# Altium schematic sheet CPU_Logic.SchDoc: Title
size A1; Date: Date; CompanyName: Integrated Micro-Electronics Bulgaria; Organization: Design & Development Department; Address1: Drawing Type; Address2: Address 1; Address3: Address 2; Address4: Address 3; DocumentNumber: 730xxx; Revision: 01; SheetNumber: 1; SheetTotal: 1; PageSetup: Record=PageOptions|CenterHorizontal=True|CenterVertical=True|PrintScale=0.70|XCorrection=1.00|YCorrection=1.00|PrintKind=2|BorderSize=5000000|LeftOffset=0|BottomOffset=0|Orientation=2|PaperLength=1000|PaperWidth=1000|Scale=100|PaperSource=7|PrintQuality=-4|MediaType=1|DitherType=10|PaperKind=A4|PrintScaleMode=1; SheetSize: A3; Time: Time; ModifiedDate: Mod. Date
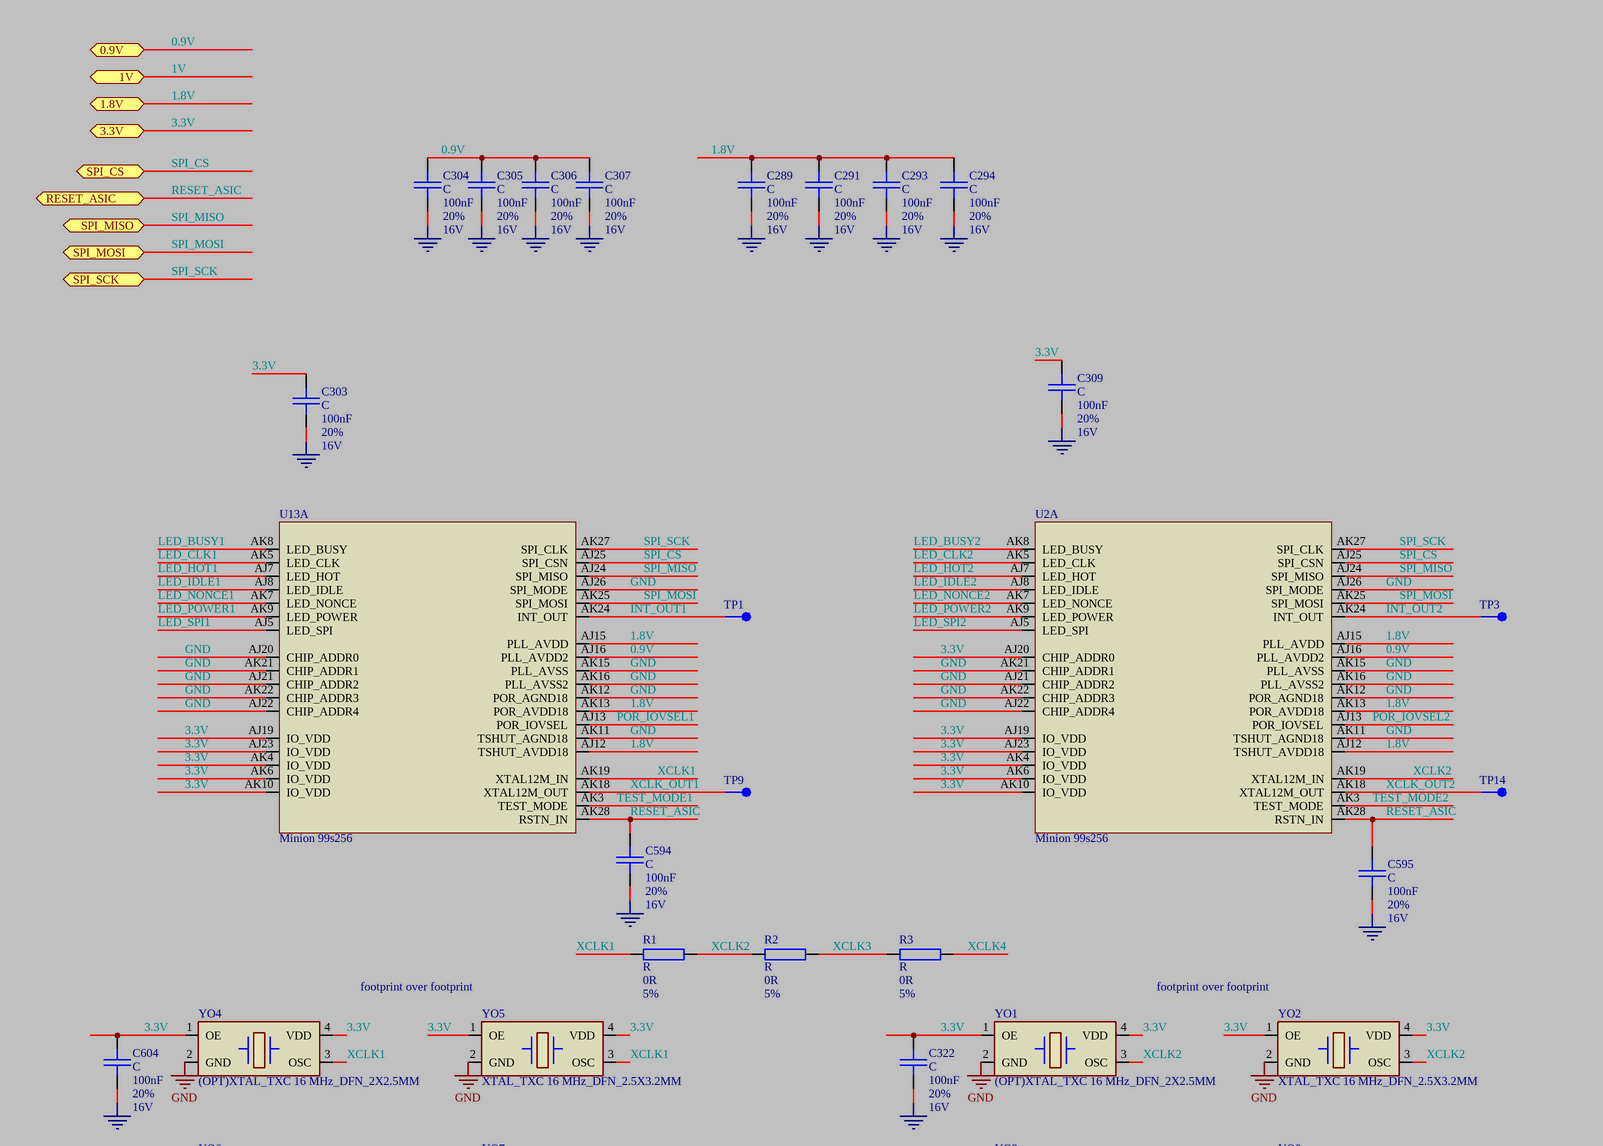
[diagram p0: CPU_Logic.SchDoc, top left]
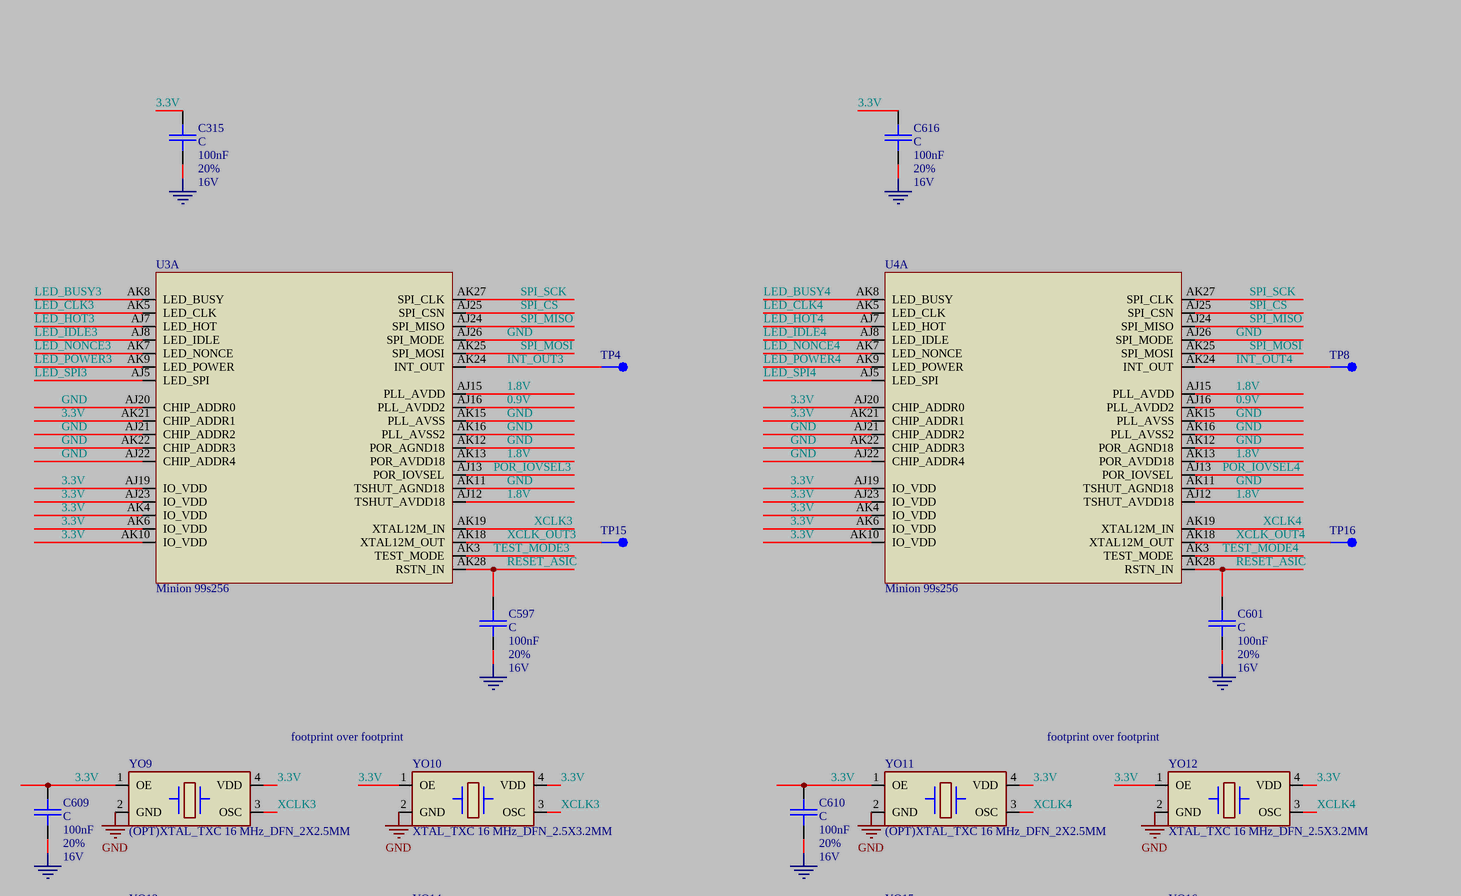
[diagram p1: CPU_Logic.SchDoc, top right]
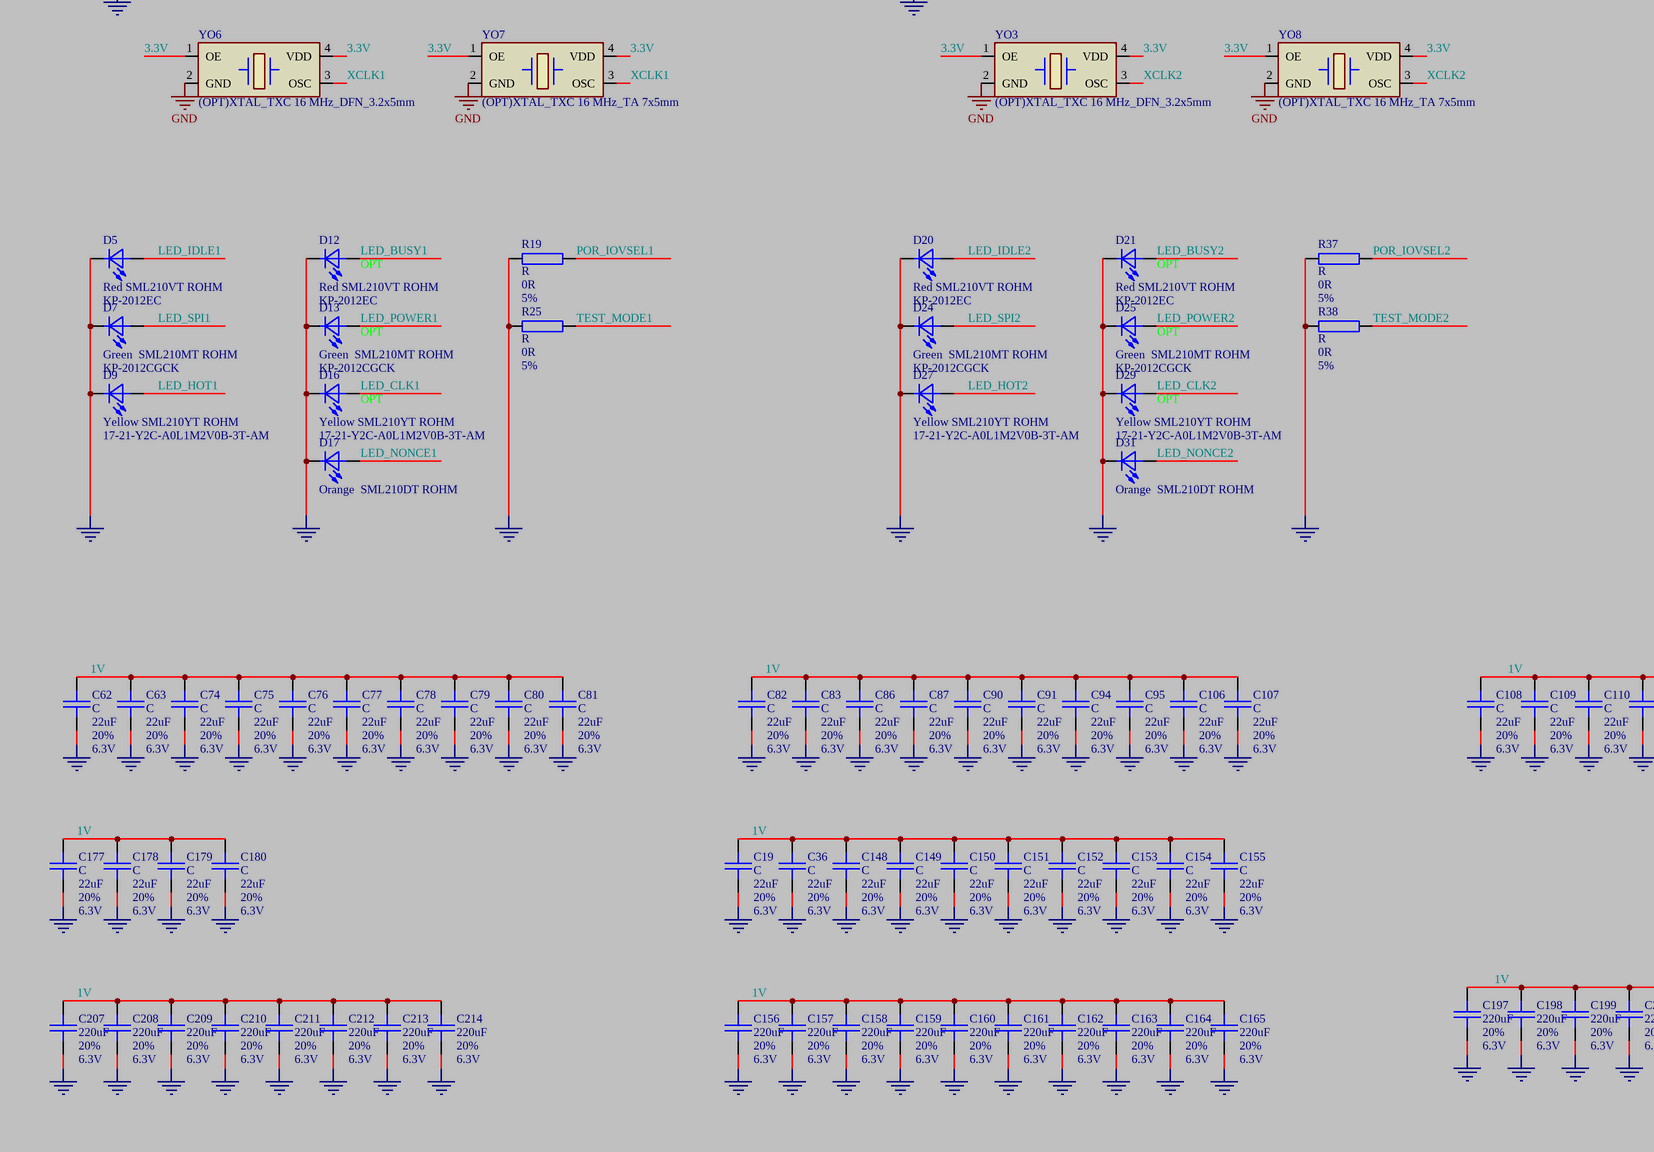
[diagram p2: CPU_Logic.SchDoc, bottom left]
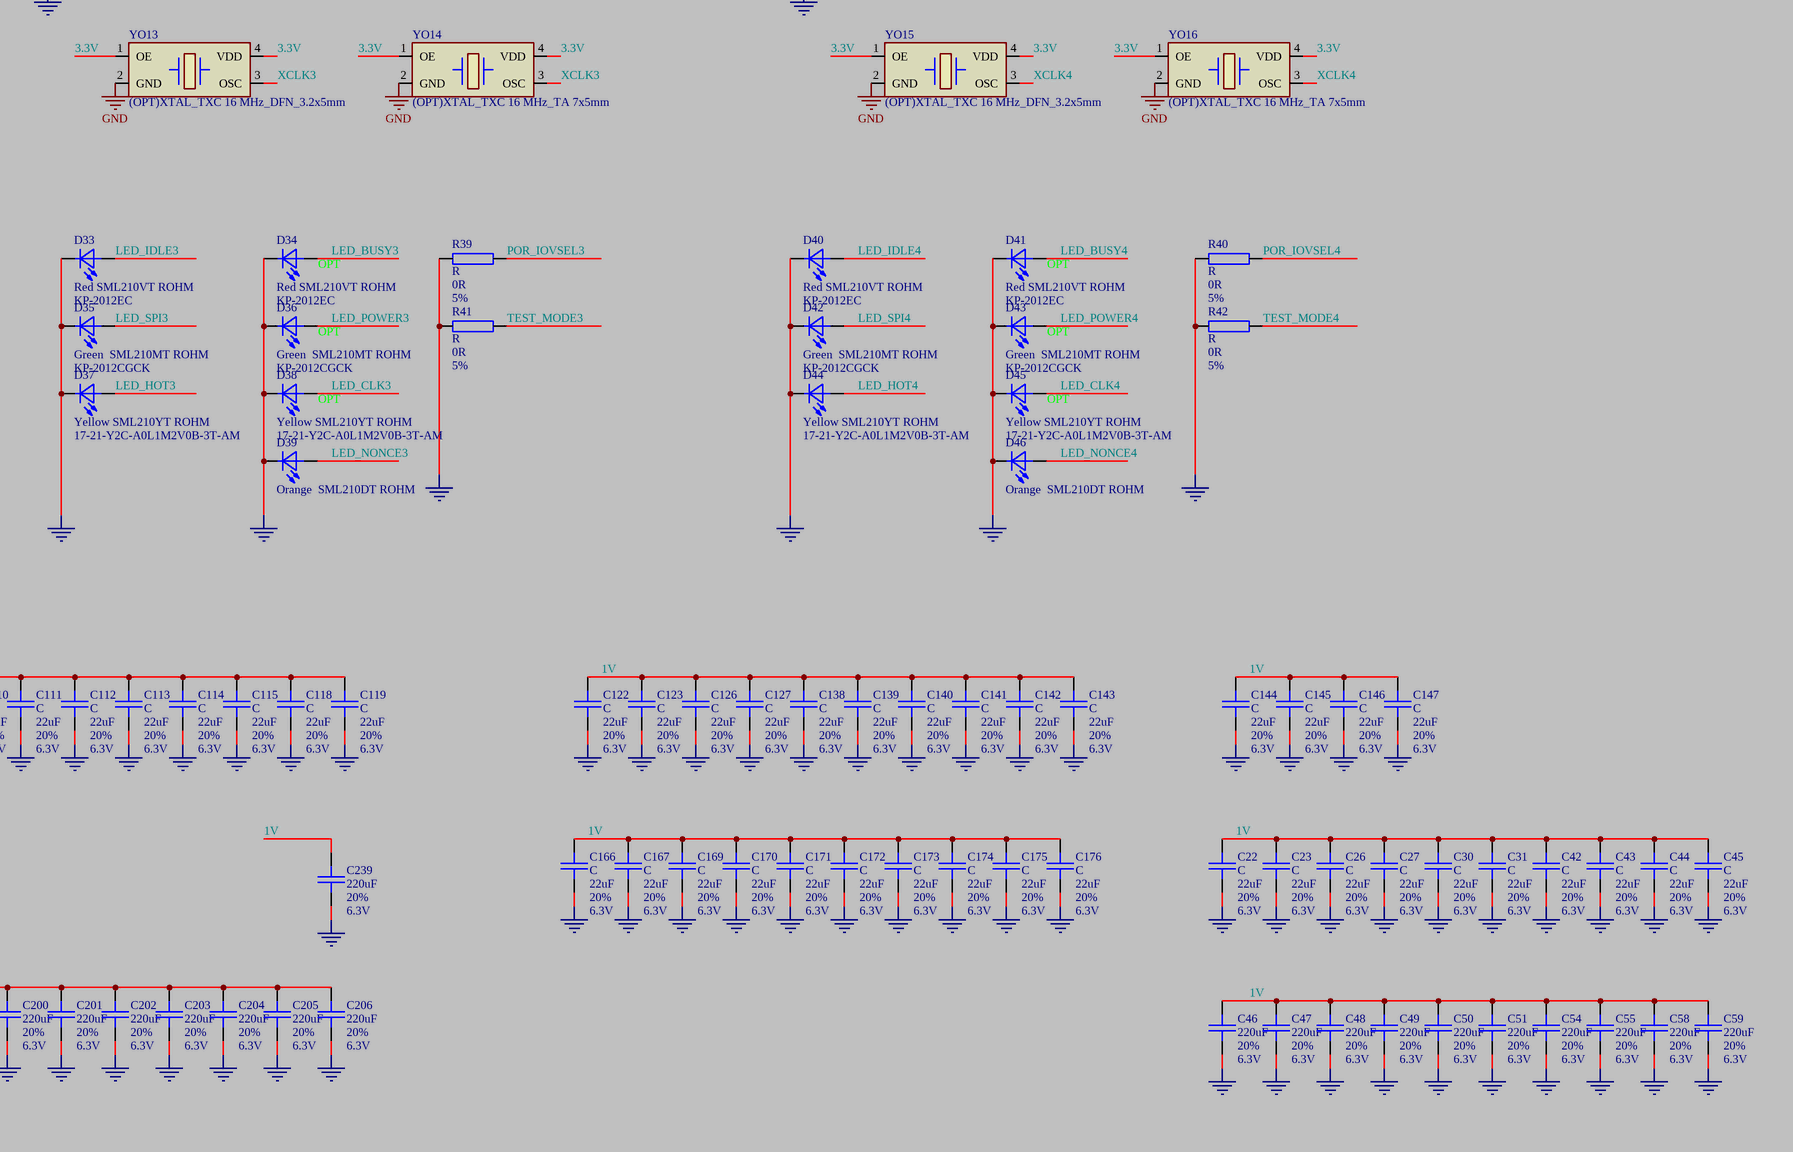
[diagram p3: CPU_Logic.SchDoc, bottom right]

## Parts
C19  C  DB_VALUE: 22uF  DB_TOLERANCE: 20%  DB_VOLTAGE: 6.3V  [SMD_0805_CAPC2012X145N]
C22  C  DB_VALUE: 22uF  DB_TOLERANCE: 20%  DB_VOLTAGE: 6.3V  [SMD_0805_CAPC2012X145N]
C23  C  DB_VALUE: 22uF  DB_TOLERANCE: 20%  DB_VOLTAGE: 6.3V  [SMD_0805_CAPC2012X145N]
C26  C  DB_VALUE: 22uF  DB_TOLERANCE: 20%  DB_VOLTAGE: 6.3V  [SMD_0805_CAPC2012X145N]
C27  C  DB_VALUE: 22uF  DB_TOLERANCE: 20%  DB_VOLTAGE: 6.3V  [SMD_0805_CAPC2012X145N]
C30  C  DB_VALUE: 22uF  DB_TOLERANCE: 20%  DB_VOLTAGE: 6.3V  [SMD_0805_CAPC2012X145N]
C31  C  DB_VALUE: 22uF  DB_TOLERANCE: 20%  DB_VOLTAGE: 6.3V  [SMD_0805_CAPC2012X145N]
C36  C  DB_VALUE: 22uF  DB_TOLERANCE: 20%  DB_VOLTAGE: 6.3V  [SMD_0805_CAPC2012X145N]
C42  C  DB_VALUE: 22uF  DB_TOLERANCE: 20%  DB_VOLTAGE: 6.3V  [SMD_0805_CAPC2012X145N]
C43  C  DB_VALUE: 22uF  DB_TOLERANCE: 20%  DB_VOLTAGE: 6.3V  [SMD_0805_CAPC2012X145N]
C44  C  DB_VALUE: 22uF  DB_TOLERANCE: 20%  DB_VOLTAGE: 6.3V  [SMD_0805_CAPC2012X145N]
C45  C  DB_VALUE: 22uF  DB_TOLERANCE: 20%  DB_VOLTAGE: 6.3V  [SMD_0805_CAPC2012X145N]
C46  DB_VALUE: 220uF  DB_TOLERANCE: 20%  DB_VOLTAGE: 6.3V  [SMD_1210_CAPC3225X279N]  (hidden comment: C)
C47  DB_VALUE: 220uF  DB_TOLERANCE: 20%  DB_VOLTAGE: 6.3V  [SMD_1210_CAPC3225X279N]  (hidden comment: C)
C48  DB_VALUE: 220uF  DB_TOLERANCE: 20%  DB_VOLTAGE: 6.3V  [SMD_1210_CAPC3225X279N]  (hidden comment: C)
C49  DB_VALUE: 220uF  DB_TOLERANCE: 20%  DB_VOLTAGE: 6.3V  [SMD_1210_CAPC3225X279N]  (hidden comment: C)
C50  DB_VALUE: 220uF  DB_TOLERANCE: 20%  DB_VOLTAGE: 6.3V  [SMD_1210_CAPC3225X279N]  (hidden comment: C)
C51  DB_VALUE: 220uF  DB_TOLERANCE: 20%  DB_VOLTAGE: 6.3V  [SMD_1210_CAPC3225X279N]  (hidden comment: C)
C54  DB_VALUE: 220uF  DB_TOLERANCE: 20%  DB_VOLTAGE: 6.3V  [SMD_1210_CAPC3225X279N]  (hidden comment: C)
C55  DB_VALUE: 220uF  DB_TOLERANCE: 20%  DB_VOLTAGE: 6.3V  [SMD_1210_CAPC3225X279N]  (hidden comment: C)
C58  DB_VALUE: 220uF  DB_TOLERANCE: 20%  DB_VOLTAGE: 6.3V  [SMD_1210_CAPC3225X279N]  (hidden comment: C)
C59  DB_VALUE: 220uF  DB_TOLERANCE: 20%  DB_VOLTAGE: 6.3V  [SMD_1210_CAPC3225X279N]  (hidden comment: C)
C62  C  DB_VALUE: 22uF  DB_TOLERANCE: 20%  DB_VOLTAGE: 6.3V  [SMD_0805_CAPC2012X145N]
C63  C  DB_VALUE: 22uF  DB_TOLERANCE: 20%  DB_VOLTAGE: 6.3V  [SMD_0805_CAPC2012X145N]
C74  C  DB_VALUE: 22uF  DB_TOLERANCE: 20%  DB_VOLTAGE: 6.3V  [SMD_0805_CAPC2012X145N]
C75  C  DB_VALUE: 22uF  DB_TOLERANCE: 20%  DB_VOLTAGE: 6.3V  [SMD_0805_CAPC2012X145N]
C76  C  DB_VALUE: 22uF  DB_TOLERANCE: 20%  DB_VOLTAGE: 6.3V  [SMD_0805_CAPC2012X145N]
C77  C  DB_VALUE: 22uF  DB_TOLERANCE: 20%  DB_VOLTAGE: 6.3V  [SMD_0805_CAPC2012X145N]
C78  C  DB_VALUE: 22uF  DB_TOLERANCE: 20%  DB_VOLTAGE: 6.3V  [SMD_0805_CAPC2012X145N]
C79  C  DB_VALUE: 22uF  DB_TOLERANCE: 20%  DB_VOLTAGE: 6.3V  [SMD_0805_CAPC2012X145N]
C80  C  DB_VALUE: 22uF  DB_TOLERANCE: 20%  DB_VOLTAGE: 6.3V  [SMD_0805_CAPC2012X145N]
C81  C  DB_VALUE: 22uF  DB_TOLERANCE: 20%  DB_VOLTAGE: 6.3V  [SMD_0805_CAPC2012X145N]
C82  C  DB_VALUE: 22uF  DB_TOLERANCE: 20%  DB_VOLTAGE: 6.3V  [SMD_0805_CAPC2012X145N]
C83  C  DB_VALUE: 22uF  DB_TOLERANCE: 20%  DB_VOLTAGE: 6.3V  [SMD_0805_CAPC2012X145N]
C86  C  DB_VALUE: 22uF  DB_TOLERANCE: 20%  DB_VOLTAGE: 6.3V  [SMD_0805_CAPC2012X145N]
C87  C  DB_VALUE: 22uF  DB_TOLERANCE: 20%  DB_VOLTAGE: 6.3V  [SMD_0805_CAPC2012X145N]
C90  C  DB_VALUE: 22uF  DB_TOLERANCE: 20%  DB_VOLTAGE: 6.3V  [SMD_0805_CAPC2012X145N]
C91  C  DB_VALUE: 22uF  DB_TOLERANCE: 20%  DB_VOLTAGE: 6.3V  [SMD_0805_CAPC2012X145N]
C94  C  DB_VALUE: 22uF  DB_TOLERANCE: 20%  DB_VOLTAGE: 6.3V  [SMD_0805_CAPC2012X145N]
C95  C  DB_VALUE: 22uF  DB_TOLERANCE: 20%  DB_VOLTAGE: 6.3V  [SMD_0805_CAPC2012X145N]
C106  C  DB_VALUE: 22uF  DB_TOLERANCE: 20%  DB_VOLTAGE: 6.3V  [SMD_0805_CAPC2012X145N]
C107  C  DB_VALUE: 22uF  DB_TOLERANCE: 20%  DB_VOLTAGE: 6.3V  [SMD_0805_CAPC2012X145N]
C108  C  DB_VALUE: 22uF  DB_TOLERANCE: 20%  DB_VOLTAGE: 6.3V  [SMD_0805_CAPC2012X145N]
C109  C  DB_VALUE: 22uF  DB_TOLERANCE: 20%  DB_VOLTAGE: 6.3V  [SMD_0805_CAPC2012X145N]
C110  C  DB_VALUE: 22uF  DB_TOLERANCE: 20%  DB_VOLTAGE: 6.3V  [SMD_0805_CAPC2012X145N]
C111  C  DB_VALUE: 22uF  DB_TOLERANCE: 20%  DB_VOLTAGE: 6.3V  [SMD_0805_CAPC2012X145N]
C112  C  DB_VALUE: 22uF  DB_TOLERANCE: 20%  DB_VOLTAGE: 6.3V  [SMD_0805_CAPC2012X145N]
C113  C  DB_VALUE: 22uF  DB_TOLERANCE: 20%  DB_VOLTAGE: 6.3V  [SMD_0805_CAPC2012X145N]
C114  C  DB_VALUE: 22uF  DB_TOLERANCE: 20%  DB_VOLTAGE: 6.3V  [SMD_0805_CAPC2012X145N]
C115  C  DB_VALUE: 22uF  DB_TOLERANCE: 20%  DB_VOLTAGE: 6.3V  [SMD_0805_CAPC2012X145N]
C118  C  DB_VALUE: 22uF  DB_TOLERANCE: 20%  DB_VOLTAGE: 6.3V  [SMD_0805_CAPC2012X145N]
C119  C  DB_VALUE: 22uF  DB_TOLERANCE: 20%  DB_VOLTAGE: 6.3V  [SMD_0805_CAPC2012X145N]
C122  C  DB_VALUE: 22uF  DB_TOLERANCE: 20%  DB_VOLTAGE: 6.3V  [SMD_0805_CAPC2012X145N]
C123  C  DB_VALUE: 22uF  DB_TOLERANCE: 20%  DB_VOLTAGE: 6.3V  [SMD_0805_CAPC2012X145N]
C126  C  DB_VALUE: 22uF  DB_TOLERANCE: 20%  DB_VOLTAGE: 6.3V  [SMD_0805_CAPC2012X145N]
C127  C  DB_VALUE: 22uF  DB_TOLERANCE: 20%  DB_VOLTAGE: 6.3V  [SMD_0805_CAPC2012X145N]
C138  C  DB_VALUE: 22uF  DB_TOLERANCE: 20%  DB_VOLTAGE: 6.3V  [SMD_0805_CAPC2012X145N]
C139  C  DB_VALUE: 22uF  DB_TOLERANCE: 20%  DB_VOLTAGE: 6.3V  [SMD_0805_CAPC2012X145N]
C140  C  DB_VALUE: 22uF  DB_TOLERANCE: 20%  DB_VOLTAGE: 6.3V  [SMD_0805_CAPC2012X145N]
C141  C  DB_VALUE: 22uF  DB_TOLERANCE: 20%  DB_VOLTAGE: 6.3V  [SMD_0805_CAPC2012X145N]
C142  C  DB_VALUE: 22uF  DB_TOLERANCE: 20%  DB_VOLTAGE: 6.3V  [SMD_0805_CAPC2012X145N]
C143  C  DB_VALUE: 22uF  DB_TOLERANCE: 20%  DB_VOLTAGE: 6.3V  [SMD_0805_CAPC2012X145N]
C144  C  DB_VALUE: 22uF  DB_TOLERANCE: 20%  DB_VOLTAGE: 6.3V  [SMD_0805_CAPC2012X145N]
C145  C  DB_VALUE: 22uF  DB_TOLERANCE: 20%  DB_VOLTAGE: 6.3V  [SMD_0805_CAPC2012X145N]
C146  C  DB_VALUE: 22uF  DB_TOLERANCE: 20%  DB_VOLTAGE: 6.3V  [SMD_0805_CAPC2012X145N]
C147  C  DB_VALUE: 22uF  DB_TOLERANCE: 20%  DB_VOLTAGE: 6.3V  [SMD_0805_CAPC2012X145N]
C148  C  DB_VALUE: 22uF  DB_TOLERANCE: 20%  DB_VOLTAGE: 6.3V  [SMD_0805_CAPC2012X145N]
C149  C  DB_VALUE: 22uF  DB_TOLERANCE: 20%  DB_VOLTAGE: 6.3V  [SMD_0805_CAPC2012X145N]
C150  C  DB_VALUE: 22uF  DB_TOLERANCE: 20%  DB_VOLTAGE: 6.3V  [SMD_0805_CAPC2012X145N]
C151  C  DB_VALUE: 22uF  DB_TOLERANCE: 20%  DB_VOLTAGE: 6.3V  [SMD_0805_CAPC2012X145N]
C152  C  DB_VALUE: 22uF  DB_TOLERANCE: 20%  DB_VOLTAGE: 6.3V  [SMD_0805_CAPC2012X145N]
C153  C  DB_VALUE: 22uF  DB_TOLERANCE: 20%  DB_VOLTAGE: 6.3V  [SMD_0805_CAPC2012X145N]
C154  C  DB_VALUE: 22uF  DB_TOLERANCE: 20%  DB_VOLTAGE: 6.3V  [SMD_0805_CAPC2012X145N]
C155  C  DB_VALUE: 22uF  DB_TOLERANCE: 20%  DB_VOLTAGE: 6.3V  [SMD_0805_CAPC2012X145N]
C156  DB_VALUE: 220uF  DB_TOLERANCE: 20%  DB_VOLTAGE: 6.3V  [SMD_1210_CAPC3225X279N]  (hidden comment: C)
C157  DB_VALUE: 220uF  DB_TOLERANCE: 20%  DB_VOLTAGE: 6.3V  [SMD_1210_CAPC3225X279N]  (hidden comment: C)
C158  DB_VALUE: 220uF  DB_TOLERANCE: 20%  DB_VOLTAGE: 6.3V  [SMD_1210_CAPC3225X279N]  (hidden comment: C)
C159  DB_VALUE: 220uF  DB_TOLERANCE: 20%  DB_VOLTAGE: 6.3V  [SMD_1210_CAPC3225X279N]  (hidden comment: C)
C160  DB_VALUE: 220uF  DB_TOLERANCE: 20%  DB_VOLTAGE: 6.3V  [SMD_1210_CAPC3225X279N]  (hidden comment: C)
C161  DB_VALUE: 220uF  DB_TOLERANCE: 20%  DB_VOLTAGE: 6.3V  [SMD_1210_CAPC3225X279N]  (hidden comment: C)
C162  DB_VALUE: 220uF  DB_TOLERANCE: 20%  DB_VOLTAGE: 6.3V  [SMD_1210_CAPC3225X279N]  (hidden comment: C)
C163  DB_VALUE: 220uF  DB_TOLERANCE: 20%  DB_VOLTAGE: 6.3V  [SMD_1210_CAPC3225X279N]  (hidden comment: C)
C164  DB_VALUE: 220uF  DB_TOLERANCE: 20%  DB_VOLTAGE: 6.3V  [SMD_1210_CAPC3225X279N]  (hidden comment: C)
C165  DB_VALUE: 220uF  DB_TOLERANCE: 20%  DB_VOLTAGE: 6.3V  [SMD_1210_CAPC3225X279N]  (hidden comment: C)
C166  C  DB_VALUE: 22uF  DB_TOLERANCE: 20%  DB_VOLTAGE: 6.3V  [SMD_0805_CAPC2012X145N]
C167  C  DB_VALUE: 22uF  DB_TOLERANCE: 20%  DB_VOLTAGE: 6.3V  [SMD_0805_CAPC2012X145N]
C169  C  DB_VALUE: 22uF  DB_TOLERANCE: 20%  DB_VOLTAGE: 6.3V  [SMD_0805_CAPC2012X145N]
C170  C  DB_VALUE: 22uF  DB_TOLERANCE: 20%  DB_VOLTAGE: 6.3V  [SMD_0805_CAPC2012X145N]
C171  C  DB_VALUE: 22uF  DB_TOLERANCE: 20%  DB_VOLTAGE: 6.3V  [SMD_0805_CAPC2012X145N]
C172  C  DB_VALUE: 22uF  DB_TOLERANCE: 20%  DB_VOLTAGE: 6.3V  [SMD_0805_CAPC2012X145N]
C173  C  DB_VALUE: 22uF  DB_TOLERANCE: 20%  DB_VOLTAGE: 6.3V  [SMD_0805_CAPC2012X145N]
C174  C  DB_VALUE: 22uF  DB_TOLERANCE: 20%  DB_VOLTAGE: 6.3V  [SMD_0805_CAPC2012X145N]
C175  C  DB_VALUE: 22uF  DB_TOLERANCE: 20%  DB_VOLTAGE: 6.3V  [SMD_0805_CAPC2012X145N]
C176  C  DB_VALUE: 22uF  DB_TOLERANCE: 20%  DB_VOLTAGE: 6.3V  [SMD_0805_CAPC2012X145N]
C177  C  DB_VALUE: 22uF  DB_TOLERANCE: 20%  DB_VOLTAGE: 6.3V  [SMD_0805_CAPC2012X145N]
C178  C  DB_VALUE: 22uF  DB_TOLERANCE: 20%  DB_VOLTAGE: 6.3V  [SMD_0805_CAPC2012X145N]
C179  C  DB_VALUE: 22uF  DB_TOLERANCE: 20%  DB_VOLTAGE: 6.3V  [SMD_0805_CAPC2012X145N]
C180  C  DB_VALUE: 22uF  DB_TOLERANCE: 20%  DB_VOLTAGE: 6.3V  [SMD_0805_CAPC2012X145N]
C197  DB_VALUE: 220uF  DB_TOLERANCE: 20%  DB_VOLTAGE: 6.3V  [SMD_1210_CAPC3225X279N]  (hidden comment: C)
C198  DB_VALUE: 220uF  DB_TOLERANCE: 20%  DB_VOLTAGE: 6.3V  [SMD_1210_CAPC3225X279N]  (hidden comment: C)
C199  DB_VALUE: 220uF  DB_TOLERANCE: 20%  DB_VOLTAGE: 6.3V  [SMD_1210_CAPC3225X279N]  (hidden comment: C)
C200  DB_VALUE: 220uF  DB_TOLERANCE: 20%  DB_VOLTAGE: 6.3V  [SMD_1210_CAPC3225X279N]  (hidden comment: C)
C201  DB_VALUE: 220uF  DB_TOLERANCE: 20%  DB_VOLTAGE: 6.3V  [SMD_1210_CAPC3225X279N]  (hidden comment: C)
C202  DB_VALUE: 220uF  DB_TOLERANCE: 20%  DB_VOLTAGE: 6.3V  [SMD_1210_CAPC3225X279N]  (hidden comment: C)
C203  DB_VALUE: 220uF  DB_TOLERANCE: 20%  DB_VOLTAGE: 6.3V  [SMD_1210_CAPC3225X279N]  (hidden comment: C)
C204  DB_VALUE: 220uF  DB_TOLERANCE: 20%  DB_VOLTAGE: 6.3V  [SMD_1210_CAPC3225X279N]  (hidden comment: C)
C205  DB_VALUE: 220uF  DB_TOLERANCE: 20%  DB_VOLTAGE: 6.3V  [SMD_1210_CAPC3225X279N]  (hidden comment: C)
C206  DB_VALUE: 220uF  DB_TOLERANCE: 20%  DB_VOLTAGE: 6.3V  [SMD_1210_CAPC3225X279N]  (hidden comment: C)
C207  DB_VALUE: 220uF  DB_TOLERANCE: 20%  DB_VOLTAGE: 6.3V  [SMD_1210_CAPC3225X279N]  (hidden comment: C)
C208  DB_VALUE: 220uF  DB_TOLERANCE: 20%  DB_VOLTAGE: 6.3V  [SMD_1210_CAPC3225X279N]  (hidden comment: C)
C209  DB_VALUE: 220uF  DB_TOLERANCE: 20%  DB_VOLTAGE: 6.3V  [SMD_1210_CAPC3225X279N]  (hidden comment: C)
C210  DB_VALUE: 220uF  DB_TOLERANCE: 20%  DB_VOLTAGE: 6.3V  [SMD_1210_CAPC3225X279N]  (hidden comment: C)
C211  DB_VALUE: 220uF  DB_TOLERANCE: 20%  DB_VOLTAGE: 6.3V  [SMD_1210_CAPC3225X279N]  (hidden comment: C)
C212  DB_VALUE: 220uF  DB_TOLERANCE: 20%  DB_VOLTAGE: 6.3V  [SMD_1210_CAPC3225X279N]  (hidden comment: C)
C213  DB_VALUE: 220uF  DB_TOLERANCE: 20%  DB_VOLTAGE: 6.3V  [SMD_1210_CAPC3225X279N]  (hidden comment: C)
C214  DB_VALUE: 220uF  DB_TOLERANCE: 20%  DB_VOLTAGE: 6.3V  [SMD_1210_CAPC3225X279N]  (hidden comment: C)
C239  DB_VALUE: 220uF  DB_TOLERANCE: 20%  DB_VOLTAGE: 6.3V  [SMD_1210_CAPC3225X279N]  (hidden comment: C)
C289  C  DB_VALUE: 100nF  DB_TOLERANCE: 20%  DB_VOLTAGE: 16V  [SMD_0603_CAPC1608X95N]
C291  C  DB_VALUE: 100nF  DB_TOLERANCE: 20%  DB_VOLTAGE: 16V  [SMD_0603_CAPC1608X95N]
C293  C  DB_VALUE: 100nF  DB_TOLERANCE: 20%  DB_VOLTAGE: 16V  [SMD_0603_CAPC1608X95N]
C294  C  DB_VALUE: 100nF  DB_TOLERANCE: 20%  DB_VOLTAGE: 16V  [SMD_0603_CAPC1608X95N]
C303  C  DB_VALUE: 100nF  DB_TOLERANCE: 20%  DB_VOLTAGE: 16V  [SMD_0603_CAPC1608X95N]
C304  C  DB_VALUE: 100nF  DB_TOLERANCE: 20%  DB_VOLTAGE: 16V  [SMD_0603_CAPC1608X95N]
C305  C  DB_VALUE: 100nF  DB_TOLERANCE: 20%  DB_VOLTAGE: 16V  [SMD_0603_CAPC1608X95N]
C306  C  DB_VALUE: 100nF  DB_TOLERANCE: 20%  DB_VOLTAGE: 16V  [SMD_0603_CAPC1608X95N]
C307  C  DB_VALUE: 100nF  DB_TOLERANCE: 20%  DB_VOLTAGE: 16V  [SMD_0603_CAPC1608X95N]
C309  C  DB_VALUE: 100nF  DB_TOLERANCE: 20%  DB_VOLTAGE: 16V  [SMD_0603_CAPC1608X95N]
C315  C  DB_VALUE: 100nF  DB_TOLERANCE: 20%  DB_VOLTAGE: 16V  [SMD_0603_CAPC1608X95N]
C322  C  DB_VALUE: 100nF  DB_TOLERANCE: 20%  DB_VOLTAGE: 16V  [SMD_0603_CAPC1608X95N]
C594  C  DB_VALUE: 100nF  DB_TOLERANCE: 20%  DB_VOLTAGE: 16V  [SMD_0603_CAPC1608X95N]
C595  C  DB_VALUE: 100nF  DB_TOLERANCE: 20%  DB_VOLTAGE: 16V  [SMD_0603_CAPC1608X95N]
C597  C  DB_VALUE: 100nF  DB_TOLERANCE: 20%  DB_VOLTAGE: 16V  [SMD_0603_CAPC1608X95N]
C601  C  DB_VALUE: 100nF  DB_TOLERANCE: 20%  DB_VOLTAGE: 16V  [SMD_0603_CAPC1608X95N]
C604  C  DB_VALUE: 100nF  DB_TOLERANCE: 20%  DB_VOLTAGE: 16V  [SMD_0603_CAPC1608X95N]
C609  C  DB_VALUE: 100nF  DB_TOLERANCE: 20%  DB_VOLTAGE: 16V  [SMD_0603_CAPC1608X95N]
C610  C  DB_VALUE: 100nF  DB_TOLERANCE: 20%  DB_VOLTAGE: 16V  [SMD_0603_CAPC1608X95N]
C616  C  DB_VALUE: 100nF  DB_TOLERANCE: 20%  DB_VOLTAGE: 16V  [SMD_0603_CAPC1608X95N]
D5  Red SML210VT ROHM  DB_VALUE: KP-2012EC  [SMD_0805_LED2012X100N]
D7  Green  SML210MT ROHM  DB_VALUE: KP-2012CGCK  [SMD_0805_LED2012X100N]
D9  Yellow SML210YT ROHM  DB_VALUE: 17-21-Y2C-A0L1M2V0B-3T-AM  [SMD_0805_LED2012X100N]
D12  Red SML210VT ROHM  DB_VALUE: KP-2012EC  [SMD_0805_LED2012X100N]
D13  Green  SML210MT ROHM  DB_VALUE: KP-2012CGCK  [SMD_0805_LED2012X100N]
D16  Yellow SML210YT ROHM  DB_VALUE: 17-21-Y2C-A0L1M2V0B-3T-AM  [SMD_0805_LED2012X100N]
D17  Orange  SML210DT ROHM  [SMD_0805_LED2012X100N]
D20  Red SML210VT ROHM  DB_VALUE: KP-2012EC  [SMD_0805_LED2012X100N]
D21  Red SML210VT ROHM  DB_VALUE: KP-2012EC  [SMD_0805_LED2012X100N]
D24  Green  SML210MT ROHM  DB_VALUE: KP-2012CGCK  [SMD_0805_LED2012X100N]
D25  Green  SML210MT ROHM  DB_VALUE: KP-2012CGCK  [SMD_0805_LED2012X100N]
D27  Yellow SML210YT ROHM  DB_VALUE: 17-21-Y2C-A0L1M2V0B-3T-AM  [SMD_0805_LED2012X100N]
D29  Yellow SML210YT ROHM  DB_VALUE: 17-21-Y2C-A0L1M2V0B-3T-AM  [SMD_0805_LED2012X100N]
D31  Orange  SML210DT ROHM  [SMD_0805_LED2012X100N]
D33  Red SML210VT ROHM  DB_VALUE: KP-2012EC  [SMD_0805_LED2012X100N]
D34  Red SML210VT ROHM  DB_VALUE: KP-2012EC  [SMD_0805_LED2012X100N]
D35  Green  SML210MT ROHM  DB_VALUE: KP-2012CGCK  [SMD_0805_LED2012X100N]
D36  Green  SML210MT ROHM  DB_VALUE: KP-2012CGCK  [SMD_0805_LED2012X100N]
D37  Yellow SML210YT ROHM  DB_VALUE: 17-21-Y2C-A0L1M2V0B-3T-AM  [SMD_0805_LED2012X100N]
D38  Yellow SML210YT ROHM  DB_VALUE: 17-21-Y2C-A0L1M2V0B-3T-AM  [SMD_0805_LED2012X100N]
D39  Orange  SML210DT ROHM  [SMD_0805_LED2012X100N]
D40  Red SML210VT ROHM  DB_VALUE: KP-2012EC  [SMD_0805_LED2012X100N]
D41  Red SML210VT ROHM  DB_VALUE: KP-2012EC  [SMD_0805_LED2012X100N]
D42  Green  SML210MT ROHM  DB_VALUE: KP-2012CGCK  [SMD_0805_LED2012X100N]
D43  Green  SML210MT ROHM  DB_VALUE: KP-2012CGCK  [SMD_0805_LED2012X100N]
D44  Yellow SML210YT ROHM  DB_VALUE: 17-21-Y2C-A0L1M2V0B-3T-AM  [SMD_0805_LED2012X100N]
D45  Yellow SML210YT ROHM  DB_VALUE: 17-21-Y2C-A0L1M2V0B-3T-AM  [SMD_0805_LED2012X100N]
D46  Orange  SML210DT ROHM  [SMD_0805_LED2012X100N]
R1  R  DB_VALUE: 0R  DB_TOLERANCE: 5%  [SMD_0603_RESC1608X55N]
R2  R  DB_VALUE: 0R  DB_TOLERANCE: 5%  [SMD_0603_RESC1608X55N]
R3  R  DB_VALUE: 0R  DB_TOLERANCE: 5%  [SMD_0603_RESC1608X55N]
R19  R  DB_VALUE: 0R  DB_TOLERANCE: 5%  [SMD_0603_RESC1608X55N]
R25  R  DB_VALUE: 0R  DB_TOLERANCE: 5%  [SMD_0603_RESC1608X55N]
R37  R  DB_VALUE: 0R  DB_TOLERANCE: 5%  [SMD_0603_RESC1608X55N]
R38  R  DB_VALUE: 0R  DB_TOLERANCE: 5%  [SMD_0603_RESC1608X55N]
R39  R  DB_VALUE: 0R  DB_TOLERANCE: 5%  [SMD_0603_RESC1608X55N]
R40  R  DB_VALUE: 0R  DB_TOLERANCE: 5%  [SMD_0603_RESC1608X55N]
R41  R  DB_VALUE: 0R  DB_TOLERANCE: 5%  [SMD_0603_RESC1608X55N]
R42  R  DB_VALUE: 0R  DB_TOLERANCE: 5%  [SMD_0603_RESC1608X55N]
TP1  TEST_POINT_1  [SMD_TP_100-254]  (value not drawn)
TP3  TEST_POINT_1  [SMD_TP_100-254]  (value not drawn)
TP4  TEST_POINT_1  [SMD_TP_100-254]  (value not drawn)
TP8  TEST_POINT_1  [SMD_TP_100-254]  (value not drawn)
TP9  TEST_POINT_1  [SMD_TP_100-254]  (value not drawn)
TP14  TEST_POINT_1  [SMD_TP_100-254]  (value not drawn)
TP15  TEST_POINT_1  [SMD_TP_100-254]  (value not drawn)
TP16  TEST_POINT_1  [SMD_TP_100-254]  (value not drawn)
U2  Minion 99s256  [SMD_BGA900C80P30X30]  (part A of 3)
U3  Minion 99s256  [SMD_BGA900C80P30X30]  (part A of 3)
U4  Minion 99s256  [SMD_BGA900C80P30X30]  (part A of 3)
U13  Minion 99s256  [SMD_BGA900C80P30X30]  (part A of 3)
YO1  (OPT)XTAL_TXC 16 MHz_DFN_2X2.5MM  [SMD_OSCCF200X250X90-4N]
YO2  XTAL_TXC 16 MHz_DFN_2.5X3.2MM  [SMD_OSCCF250X320X90-4N]
YO3  (OPT)XTAL_TXC 16 MHz_DFN_3.2x5mm  [SMD_OSCCF320X400X90-4N]
YO4  (OPT)XTAL_TXC 16 MHz_DFN_2X2.5MM  [SMD_OSCCF200X250X90-4N]
YO5  XTAL_TXC 16 MHz_DFN_2.5X3.2MM  [SMD_OSCCF250X320X90-4N]
YO6  (OPT)XTAL_TXC 16 MHz_DFN_3.2x5mm  [SMD_OSCCF320X400X90-4N]
YO7  (OPT)XTAL_TXC 16 MHz_TA 7x5mm  [SMD_OSCCC500X700X100-4N]
YO8  (OPT)XTAL_TXC 16 MHz_TA 7x5mm  [SMD_OSCCC500X700X100-4N]
YO9  (OPT)XTAL_TXC 16 MHz_DFN_2X2.5MM  [SMD_OSCCF200X250X90-4N]
YO10  XTAL_TXC 16 MHz_DFN_2.5X3.2MM  [SMD_OSCCF250X320X90-4N]
YO11  (OPT)XTAL_TXC 16 MHz_DFN_2X2.5MM  [SMD_OSCCF200X250X90-4N]
YO12  XTAL_TXC 16 MHz_DFN_2.5X3.2MM  [SMD_OSCCF250X320X90-4N]
YO13  (OPT)XTAL_TXC 16 MHz_DFN_3.2x5mm  [SMD_OSCCF320X400X90-4N]
YO14  (OPT)XTAL_TXC 16 MHz_TA 7x5mm  [SMD_OSCCC500X700X100-4N]
YO15  (OPT)XTAL_TXC 16 MHz_DFN_3.2x5mm  [SMD_OSCCF320X400X90-4N]
YO16  (OPT)XTAL_TXC 16 MHz_TA 7x5mm  [SMD_OSCCC500X700X100-4N]

## Ports
0.9V, 1.8V, 1V, 3.3V, RESET_ASIC, SPI_CS, SPI_MISO, SPI_MOSI, SPI_SCK

## Nets
GND: C19.1 C22.1 C23.1 C26.1 C27.1 C30.1 C31.1 C36.1 C42.1 C43.1 C44.1 C45.1 C46.1 C47.1 C48.1 C49.1 C50.1 C51.1 C54.1 C55.1 C58.1 C59.1 C62.1 C63.1 C74.1 C75.1 C76.1 C77.1 C78.1 C79.1 C80.1 C81.1 C82.1 C83.1 C86.1 C87.1 C90.1 C91.1 C94.1 C95.1 C106.1 C107.1 C108.1 C109.1 C110.1 C111.1 C112.1 C113.1 C114.1 C115.1 C118.1 C119.1 C122.1 C123.1 C126.1 C127.1 C138.1 C139.1 C140.1 C141.1 C142.1 C143.1 C144.1 C145.1 C146.1 C147.1 C148.1 C149.1 C150.1 C151.1 C152.1 C153.1 C154.1 C155.1 C156.1 C157.1 C158.1 C159.1 C160.1 C161.1 C162.1 C163.1 C164.1 C165.1 C166.1 C167.1 C169.1 C170.1 C171.1 C172.1 C173.1 C174.1 C175.1 C176.1 C177.1 C178.1 C179.1 C180.1 C197.1 C198.1 C199.1 C200.1 C201.1 C202.1 C203.1 C204.1 C205.1 C206.1 C207.1 C208.1 C209.1 C210.1 C211.1 C212.1 C213.1 C214.1 C239.1 C289.1 C291.1 C293.1 C294.1 C303.1 C304.1 C305.1 C306.1 C307.1 C309.1 C315.1 C322.2 C594.2 C595.2 C597.2 C601.2 C604.2 C609.2 C610.2 C616.1 D5.1(C) D7.1(C) D9.1(C) D12.1(C) D13.1(C) D16.1(C) D17.1(C) D20.1(C) D21.1(C) D24.1(C) D25.1(C) D27.1(C) D29.1(C) D31.1(C) D33.1(C) D34.1(C) D35.1(C) D36.1(C) D37.1(C) D38.1(C) D39.1(C) D40.1(C) D41.1(C) D42.1(C) D43.1(C) D44.1(C) D45.1(C) D46.1(C) R19.1 R25.1 R37.1 R38.1 R39.1 R40.1 R41.1 R42.1 U2.AJ21(CHIP_ADDR2) U2.AJ22(CHIP_ADDR4) U2.AJ26(SPI_MODE) U2.AK11(TSHUT_AGND18) U2.AK12(POR_AGND18) U2.AK15(PLL_AVSS) U2.AK16(PLL_AVSS2) U2.AK21(CHIP_ADDR1) U2.AK22(CHIP_ADDR3) U3.AJ20(CHIP_ADDR0) U3.AJ21(CHIP_ADDR2) U3.AJ22(CHIP_ADDR4) U3.AJ26(SPI_MODE) U3.AK11(TSHUT_AGND18) U3.AK12(POR_AGND18) U3.AK15(PLL_AVSS) U3.AK16(PLL_AVSS2) U3.AK22(CHIP_ADDR3) U4.AJ21(CHIP_ADDR2) U4.AJ22(CHIP_ADDR4) U4.AJ26(SPI_MODE) U4.AK11(TSHUT_AGND18) U4.AK12(POR_AGND18) U4.AK15(PLL_AVSS) U4.AK16(PLL_AVSS2) U4.AK22(CHIP_ADDR3) U13.AJ20(CHIP_ADDR0) U13.AJ21(CHIP_ADDR2) U13.AJ22(CHIP_ADDR4) U13.AJ26(SPI_MODE) U13.AK11(TSHUT_AGND18) U13.AK12(POR_AGND18) U13.AK15(PLL_AVSS) U13.AK16(PLL_AVSS2) U13.AK21(CHIP_ADDR1) U13.AK22(CHIP_ADDR3) YO1.2(GND) YO2.2(GND) YO3.2(GND) YO4.2(GND) YO5.2(GND) YO6.2(GND) YO7.2(GND) YO8.2(GND) YO9.2(GND) YO10.2(GND) YO11.2(GND) YO12.2(GND) YO13.2(GND) YO14.2(GND) YO15.2(GND) YO16.2(GND)
0.9V: C304.2 C305.2 C306.2 C307.2 U2.AJ16(PLL_AVDD2) U3.AJ16(PLL_AVDD2) U4.AJ16(PLL_AVDD2) U13.AJ16(PLL_AVDD2) ; port 0.9V
1.8V: C289.2 C291.2 C293.2 C294.2 U2.AJ12(TSHUT_AVDD18) U2.AJ15(PLL_AVDD) U2.AK13(POR_AVDD18) U3.AJ12(TSHUT_AVDD18) U3.AJ15(PLL_AVDD) U3.AK13(POR_AVDD18) U4.AJ12(TSHUT_AVDD18) U4.AJ15(PLL_AVDD) U4.AK13(POR_AVDD18) U13.AJ12(TSHUT_AVDD18) U13.AJ15(PLL_AVDD) U13.AK13(POR_AVDD18) ; port 1.8V
1V: C19.2 C22.2 C23.2 C26.2 C27.2 C30.2 C31.2 C36.2 C42.2 C43.2 C44.2 C45.2 C46.2 C47.2 C48.2 C49.2 C50.2 C51.2 C54.2 C55.2 C58.2 C59.2 C62.2 C63.2 C74.2 C75.2 C76.2 C77.2 C78.2 C79.2 C80.2 C81.2 C82.2 C83.2 C86.2 C87.2 C90.2 C91.2 C94.2 C95.2 C106.2 C107.2 C108.2 C109.2 C110.2 C111.2 C112.2 C113.2 C114.2 C115.2 C118.2 C119.2 C122.2 C123.2 C126.2 C127.2 C138.2 C139.2 C140.2 C141.2 C142.2 C143.2 C144.2 C145.2 C146.2 C147.2 C148.2 C149.2 C150.2 C151.2 C152.2 C153.2 C154.2 C155.2 C156.2 C157.2 C158.2 C159.2 C160.2 C161.2 C162.2 C163.2 C164.2 C165.2 C166.2 C167.2 C169.2 C170.2 C171.2 C172.2 C173.2 C174.2 C175.2 C176.2 C177.2 C178.2 C179.2 C180.2 C197.2 C198.2 C199.2 C200.2 C201.2 C202.2 C203.2 C204.2 C205.2 C206.2 C207.2 C208.2 C209.2 C210.2 C211.2 C212.2 C213.2 C214.2 C239.2 ; port 1V
3.3V: C303.2 C309.2 C315.2 C322.1 C604.1 C609.1 C610.1 C616.2 U2.AJ19(IO_VDD) U2.AJ20(CHIP_ADDR0) U2.AJ23(IO_VDD) U2.AK4(IO_VDD) U2.AK6(IO_VDD) U2.AK10(IO_VDD) U3.AJ19(IO_VDD) U3.AJ23(IO_VDD) U3.AK4(IO_VDD) U3.AK6(IO_VDD) U3.AK10(IO_VDD) U3.AK21(CHIP_ADDR1) U4.AJ19(IO_VDD) U4.AJ20(CHIP_ADDR0) U4.AJ23(IO_VDD) U4.AK4(IO_VDD) U4.AK6(IO_VDD) U4.AK10(IO_VDD) U4.AK21(CHIP_ADDR1) U13.AJ19(IO_VDD) U13.AJ23(IO_VDD) U13.AK4(IO_VDD) U13.AK6(IO_VDD) U13.AK10(IO_VDD) YO1.1(OE) YO1.4(VDD) YO2.1(OE) YO2.4(VDD) YO3.1(OE) YO3.4(VDD) YO4.1(OE) YO4.4(VDD) YO5.1(OE) YO5.4(VDD) YO6.1(OE) YO6.4(VDD) YO7.1(OE) YO7.4(VDD) YO8.1(OE) YO8.4(VDD) YO9.1(OE) YO9.4(VDD) YO10.1(OE) YO10.4(VDD) YO11.1(OE) YO11.4(VDD) YO12.1(OE) YO12.4(VDD) YO13.1(OE) YO13.4(VDD) YO14.1(OE) YO14.4(VDD) YO15.1(OE) YO15.4(VDD) YO16.1(OE) YO16.4(VDD) ; port 3.3V
INT_OUT1: TP1.1 U13.AK24(INT_OUT)
INT_OUT2: TP3.1 U2.AK24(INT_OUT)
INT_OUT3: TP4.1 U3.AK24(INT_OUT)
INT_OUT4: TP8.1 U4.AK24(INT_OUT)
LED_BUSY1: D12.2(A) U13.AK8(LED_BUSY)
LED_BUSY2: D21.2(A) U2.AK8(LED_BUSY)
LED_BUSY3: D34.2(A) U3.AK8(LED_BUSY)
LED_BUSY4: D41.2(A) U4.AK8(LED_BUSY)
LED_CLK1: D16.2(A) U13.AK5(LED_CLK)
LED_CLK2: D29.2(A) U2.AK5(LED_CLK)
LED_CLK3: D38.2(A) U3.AK5(LED_CLK)
LED_CLK4: D45.2(A) U4.AK5(LED_CLK)
LED_HOT1: D9.2(A) U13.AJ7(LED_HOT)
LED_HOT2: D27.2(A) U2.AJ7(LED_HOT)
LED_HOT3: D37.2(A) U3.AJ7(LED_HOT)
LED_HOT4: D44.2(A) U4.AJ7(LED_HOT)
LED_IDLE1: D5.2(A) U13.AJ8(LED_IDLE)
LED_IDLE2: D20.2(A) U2.AJ8(LED_IDLE)
LED_IDLE3: D33.2(A) U3.AJ8(LED_IDLE)
LED_IDLE4: D40.2(A) U4.AJ8(LED_IDLE)
LED_NONCE1: D17.2(A) U13.AK7(LED_NONCE)
LED_NONCE2: D31.2(A) U2.AK7(LED_NONCE)
LED_NONCE3: D39.2(A) U3.AK7(LED_NONCE)
LED_NONCE4: D46.2(A) U4.AK7(LED_NONCE)
LED_POWER1: D13.2(A) U13.AK9(LED_POWER)
LED_POWER2: D25.2(A) U2.AK9(LED_POWER)
LED_POWER3: D36.2(A) U3.AK9(LED_POWER)
LED_POWER4: D43.2(A) U4.AK9(LED_POWER)
LED_SPI1: D7.2(A) U13.AJ5(LED_SPI)
LED_SPI2: D24.2(A) U2.AJ5(LED_SPI)
LED_SPI3: D35.2(A) U3.AJ5(LED_SPI)
LED_SPI4: D42.2(A) U4.AJ5(LED_SPI)
POR_IOVSEL1: R19.2 U13.AJ13(POR_IOVSEL)
POR_IOVSEL2: R37.2 U2.AJ13(POR_IOVSEL)
POR_IOVSEL3: R39.2 U3.AJ13(POR_IOVSEL)
POR_IOVSEL4: R40.2 U4.AJ13(POR_IOVSEL)
RESET_ASIC: C594.1 C595.1 C597.1 C601.1 U2.AK28(RSTN_IN) U3.AK28(RSTN_IN) U4.AK28(RSTN_IN) U13.AK28(RSTN_IN) ; port RESET_ASIC
SPI_CS: U2.AJ25(SPI_CSN) U3.AJ25(SPI_CSN) U4.AJ25(SPI_CSN) U13.AJ25(SPI_CSN) ; port SPI_CS
SPI_MISO: U2.AJ24(SPI_MISO) U3.AJ24(SPI_MISO) U4.AJ24(SPI_MISO) U13.AJ24(SPI_MISO) ; port SPI_MISO
SPI_MOSI: U2.AK25(SPI_MOSI) U3.AK25(SPI_MOSI) U4.AK25(SPI_MOSI) U13.AK25(SPI_MOSI) ; port SPI_MOSI
SPI_SCK: U2.AK27(SPI_CLK) U3.AK27(SPI_CLK) U4.AK27(SPI_CLK) U13.AK27(SPI_CLK) ; port SPI_SCK
TEST_MODE1: R25.2 U13.AK3(TEST_MODE)
TEST_MODE2: R38.2 U2.AK3(TEST_MODE)
TEST_MODE3: R41.2 U3.AK3(TEST_MODE)
TEST_MODE4: R42.2 U4.AK3(TEST_MODE)
XCLK1: R1.1 U13.AK19(XTAL12M_IN) YO4.3(OSC) YO5.3(OSC) YO6.3(OSC) YO7.3(OSC)
XCLK2: R1.2 R2.1 U2.AK19(XTAL12M_IN) YO1.3(OSC) YO2.3(OSC) YO3.3(OSC) YO8.3(OSC)
XCLK3: R2.2 R3.1 U3.AK19(XTAL12M_IN) YO9.3(OSC) YO10.3(OSC) YO13.3(OSC) YO14.3(OSC)
XCLK4: R3.2 U4.AK19(XTAL12M_IN) YO11.3(OSC) YO12.3(OSC) YO15.3(OSC) YO16.3(OSC)
XCLK_OUT1: TP9.1 U13.AK18(XTAL12M_OUT)
XCLK_OUT2: TP14.1 U2.AK18(XTAL12M_OUT)
XCLK_OUT3: TP15.1 U3.AK18(XTAL12M_OUT)
XCLK_OUT4: TP16.1 U4.AK18(XTAL12M_OUT)

## Notes on the sheet
- footprint over footprint
- (near D12) OPT
- (near D21) OPT
- (near D34) OPT
- (near D41) OPT
- (near D13) OPT
- (near D25) OPT
- (near D36) OPT
- (near D43) OPT
- (near D16) OPT
- (near D29) OPT
- (near D38) OPT
- (near D45) OPT

## Library data of the parts
C19 C22 C23 C26 C27 C30 C31 C36 C42-C45 C62 C63 C74-C83 C86 C87 C90 C91 C94 C95 C106-C115 C118 C119 C122 C123 C126 C127 C138-C155 C166 C167 C169-C180 = CAP000043686: DB_PART_TYPE: Ceramic_SMD\Standard_X5R; DB_MANUFACTURER_PART: KEMET    C0805C226M9PAC; NOTE: <NOTE>; DB_T_RANGE: -55 to 85; DB_PACKAGE: 0805; DB_DESCRIPTION: C X5R 22uF 20% 6.3V 0805; DB_CERTIFIED: ISHIDDEN=T; DB_STATUS: NEW; DB_PART_NUMBER: CAP000043686; DB_PCB_DEVICE: SMD_0805_CAPC2012X145N; DB_PRICE: ISHIDDEN=T; DB_LEADTIME: ISHIDDEN=T; DB_MOQ: ISHIDDEN=T; DB_PRICE_DATE: ISHIDDEN=T; DB_APPROVED_BY: ISHIDDEN=T; DB_APPROVED_ON: 09.10.2010; DB_DATASHEET: http://john.epiqdesign.com/projects/CIS_Datasheets/F3102_CE_Kemet.pdf?rev=92&sc=0
C46-C51 C54 C55 C58 C59 C156-C165 C197-C214 C239 = CAP000047355: DB_PART_TYPE: Ceramic_SMD\Standard_X5R; DB_MANUFACTURER_PART: SAMSUNG    CL32A227MQVNNNE; NOTE: <NOTE>; DB_T_RANGE: -55 to 85; DB_PACKAGE: 1210; DB_DESCRIPTION: C X5R 220uF 20% 6.3V 1210; DB_CERTIFIED: ISHIDDEN=T; DB_APPROVED_BY: VSN; DB_STATUS: NEW; DB_PART_NUMBER: CAP000047355; DB_PCB_DEVICE: SMD_1210_CAPC3225X279N; DB_APPROVED_ON: 07.05.2014 11:28:08; DB_DATASHEET: http://john.epiqdesign.com/projects/CIS_Datasheets/CAP_CL32A227MQVNNNE.pdf?rev=1401&sc=0
C289 C291 C293 C294 C303-C307 C309 C315 C322 C594 C595 C597 C601 C604 C609 C610 C616 = CAP000027236: DB_PART_TYPE: Ceramic_SMD\Standard_X7R; DB_MANUFACTURER_PART: KEMET    C0603C104M4RAC; NOTE: <NOTE>; DB_T_RANGE: -55 to 125; DB_PACKAGE: 0603; DB_DESCRIPTION: C X7R 100nF 20% 16V 0603; DB_CERTIFIED: ISHIDDEN=T; DB_STATUS: NEW; DB_PART_NUMBER: CAP000027236; DB_PCB_DEVICE: SMD_0603_CAPC1608X95N; DB_PRICE: ISHIDDEN=T; DB_LEADTIME: ISHIDDEN=T; DB_MOQ: ISHIDDEN=T; DB_PRICE_DATE: ISHIDDEN=T; DB_APPROVED_BY: ISHIDDEN=T; DB_APPROVED_ON: 09.10.2010; DB_DATASHEET: http://john.epiqdesign.com/projects/CIS_Datasheets/F3102_CE_Kemet.pdf?rev=92&sc=0
D5 D12 D20 D21 D33 D34 D40 D41 = OPT000000095: DB_MANUFACTURER_PART: KINGBRIGHT       KP-2012EC; NOTE: <NOTE>; DB_T_RANGE: -40 to 85; DB_PACKAGE: 0805; DB_DESCRIPTION: LED RED 0805; DB_CERTIFIED: ISHIDDEN=T; DB_APPROVED_BY: VSN; DB_STATUS: NEW; DB_PCB_DEVICE: SMD_0805_LED2012X100N; DB_PART_NUMBER: OPT000000095; DB_PART_TYPE: LED; DB_COLOUR: RED; DB_APPROVED_ON: 08.04.2014 09:20:29; DB_DATASHEET: http://john.epiqdesign.com/projects/CIS_Datasheets/LED_KP-2012EC_0805_RED.pdf?rev=1358&sc=0
D7 D13 D24 D25 D35 D36 D42 D43 = OPT000000096: DB_MANUFACTURER_PART: KINGBRIGHT       KP-2012CGCK; NOTE: <NOTE>; DB_T_RANGE: -40 to 85; DB_PACKAGE: 0805; DB_DESCRIPTION: LED GREEN 0805; DB_CERTIFIED: ISHIDDEN=T; DB_APPROVED_BY: VSN; DB_STATUS: NEW; DB_PCB_DEVICE: SMD_0805_LED2012X100N; DB_PART_NUMBER: OPT000000096; DB_PART_TYPE: LED; DB_COLOUR: GREEN; DB_APPROVED_ON: 08.04.2014 09:22:12; DB_DATASHEET: http://john.epiqdesign.com/projects/CIS_Datasheets/LED_KP-2012CGCK_0805_GREEN.pdf?rev=1359&sc=0
D9 D16 D27 D29 D37 D38 D44 D45 = OPT000000092: DB_MANUFACTURER_PART: EVERLIGHT       17-21-Y2C-A0L1M2V0B-3T-AM; NOTE: <NOTE>; DB_T_RANGE: -40 to 100; DB_PACKAGE: 0805; DB_DESCRIPTION: LED YELLOW 0805; DB_CERTIFIED: AUT; DB_APPROVED_BY: VSN; DB_STATUS: NEW; DB_PCB_DEVICE: SMD_0805_LED2012X100N; DB_PART_NUMBER: OPT000000092; DB_PART_TYPE: LED; DB_COLOUR: YELLOW; DB_APPROVED_ON: 17.06.2013 13:21:58; DB_DATASHEET: http://john.epiqdesign.com/projects/CIS_Datasheets/LED_17-21-Y2C-A0L1M2V0B-3T-AM.pdf?rev=1220&sc=0
D17 D31 D39 D46 = OPT000000096: DB_PART_TYPE: LED; DB_MANUFACTURER_PART: KINGBRIGHT       KP-2012CGCK; NOTE: <NOTE>; DB_T_RANGE: -40 to 85; DB_COLOUR: GREEN; DB_PACKAGE: 0805; DB_DESCRIPTION: LED GREEN 0805; DB_CERTIFIED: ISHIDDEN=T; DB_APPROVED_BY: VSN; DB_STATUS: NEW; DB_VALUE: KP-2012CGCK; DB_PCB_DEVICE: SMD_0805_LED2012X100N; DB_PART_NUMBER: OPT000000096; DB_APPROVED_ON: 08.04.2014 09:22:12; DB_DATASHEET: http://john.epiqdesign.com/projects/CIS_Datasheets/LED_KP-2012CGCK_0805_GREEN.pdf?rev=1359&sc=0
R1-R3 R19 R25 R37-R42 = RES000006349: DB_PART_TYPE: SMD; DB_MANUFACTURER_PART: YAGEO    RC0603JR-070R; NOTE: <NOTE>; DB_T_RANGE: -55 to 155; DB_POWER: 1/10W; DB_PACKAGE: 0603; DB_DESCRIPTION: R SMD 0R 5% 1/10W 0603; DB_CERTIFIED: ISHIDDEN=T; DB_PRICE: 0.000364; DB_MOQ: 5000; DB_STATUS: NEW; R_BDS: R; DB_PART_NUMBER: RES000006349; DB_PCB_DEVICE: SMD_0603_RESC1608X55N; DB_PRICE_DATE: 2010-12-23; DB_APPROVED_BY: ISHIDDEN=T; DB_APPROVED_ON: 09.10.2010; DB_DATASHEET: http://john.epiqdesign.com/projects/CIS_Datasheets/PYu-RC0603_51_RoHS_L_4_YAGEO.pdf?rev=138&sc=0
TP1 TP3 TP4 TP8 TP9 TP14-TP16 = TPO000000001: DB_PART_TYPE: Test Point; DB_VALUE: 100_254; DB_PACKAGE: ISHIDDEN=T; DB_DESCRIPTION: Test Point 100_254; DB_STATUS: NEW; DB_PART_NUMBER: TPO000000001; DB_DIAMETER: 100_254; DB_PCB_DEVICE: SMD_TP_100-254; DB_MANUFACTURER_PART: ISHIDDEN=T; DB_CERTIFIED: ISHIDDEN=T; DB_PRICE: ISHIDDEN=T; DB_LEADTIME: ISHIDDEN=T; DB_MOQ: ISHIDDEN=T; DB_PRICE_DATE: ISHIDDEN=T; DB_APPROVED_BY: ISHIDDEN=T; DB_APPROVED_ON: 10.09.2010; DB_DATASHEET: ISHIDDEN=T
YO1 YO4 YO9 YO11 = SMD_OSC_DFN_2X2.5MM: NOTE: <NOTE>; DB_PCB_DEVICE: SMD_OSCCF200X250X90-4N
YO2 YO5 YO10 YO12 = SMD_OSC_DFN_2.5X3.2MM: NOTE: <NOTE>; DB_PCB_DEVICE: SMD_OSCCF250X320X90-4N
YO3 YO6 YO13 YO15 = SMD_OSC_DFN_3.2x5mm: NOTE: <NOTE>; DB_PCB_DEVICE: SMD_OSCCF320X400X90-4N
YO7 YO8 YO14 YO16 = SMD_OSC_TA 7x5mm: NOTE: <NOTE>; DB_PCB_DEVICE: SMD_OSCCC500X700X100-4N
U2-U4 U13 = Minion 99s256: DB_PCB_DEVICE: SMD_BGA900C80P30X30